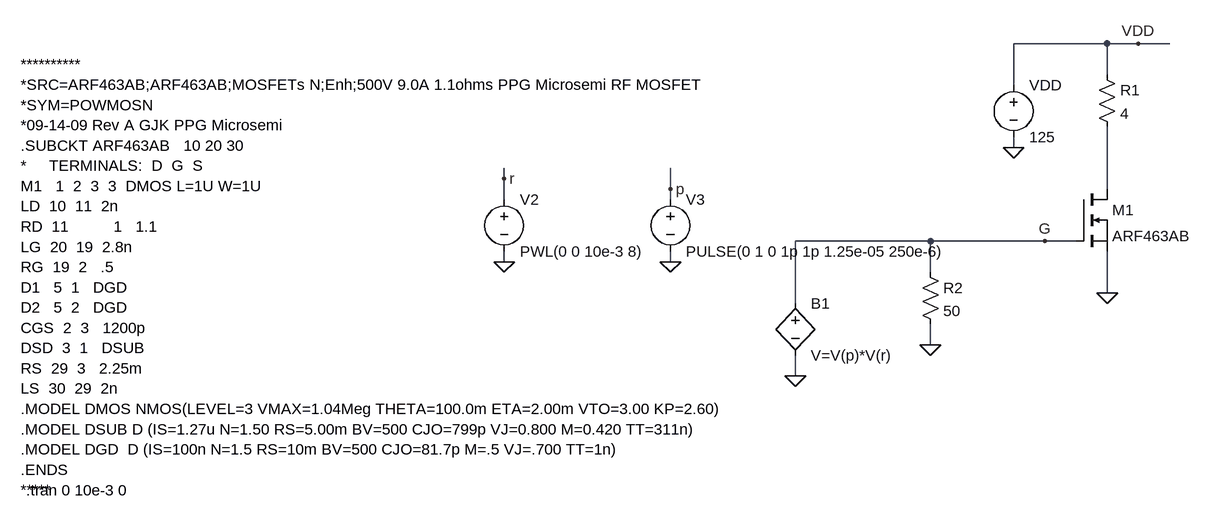
[diagram p0: schematic mosfet.asc]
mosfet.asc, the LTspice schematic file:
Version 4
SHEET 1 880 680
WIRE -480 -784 -624 -784
WIRE -432 -784 -480 -784
WIRE -384 -784 -432 -784
WIRE -480 -736 -480 -784
WIRE -624 -720 -624 -784
WIRE -624 -624 -624 -640
WIRE -1408 -576 -1408 -592
WIRE -1152 -560 -1152 -592
WIRE -480 -560 -480 -656
WIRE -1408 -544 -1408 -576
WIRE -1152 -544 -1152 -560
WIRE -752 -480 -960 -480
WIRE -576 -480 -752 -480
WIRE -528 -480 -576 -480
WIRE -1408 -448 -1408 -464
WIRE -1152 -448 -1152 -464
WIRE -752 -432 -752 -480
WIRE -480 -400 -480 -464
WIRE -960 -384 -960 -480
WIRE -752 -320 -752 -352
WIRE -960 -272 -960 -304
FLAG -480 -400 0
FLAG -624 -624 0
FLAG -432 -784 VDD
FLAG -576 -480 G
FLAG -752 -320 0
FLAG -960 -272 0
FLAG -1408 -448 0
FLAG -1152 -448 0
FLAG -1152 -560 p
FLAG -1408 -576 r
SYMBOL nmos -528 -560 R0
SYMATTR InstName M1
SYMATTR Value ARF463AB
SYMATTR Prefix X
SYMBOL voltage -624 -736 R0
WINDOW 123 0 0 Left 2
WINDOW 39 0 0 Left 2
SYMATTR InstName VDD
SYMATTR Value 125
SYMBOL res -496 -752 R0
SYMATTR InstName R1
SYMATTR Value 4
SYMBOL res -768 -448 R0
SYMATTR InstName R2
SYMATTR Value 50
SYMBOL bv -960 -400 R0
SYMATTR InstName B1
SYMATTR Value V=V(p)*V(r)
SYMBOL voltage -1408 -560 R0
WINDOW 123 0 0 Left 2
WINDOW 39 0 0 Left 2
SYMATTR InstName V2
SYMATTR Value PWL(0 0 10e-3 8)
SYMBOL voltage -1152 -560 R0
WINDOW 123 0 0 Left 2
WINDOW 39 0 0 Left 2
SYMATTR InstName V3
SYMATTR Value PULSE(0 1 0 1p 1p 1.25e-05 250e-6)
TEXT -2144 -96 Left 2 !.tran 0 10e-3 0
TEXT -2152 -752 Left 2 !**********\n*SRC=ARF463AB;ARF463AB;MOSFETs N;Enh;500V 9.0A 1.1ohms PPG Microsemi RF MOSFET\n*SYM=POWMOSN\n*09-14-09 Rev A GJK PPG Microsemi\n.SUBCKT ARF463AB   10 20 30\n*     TERMINALS:  D  G  S\nM1   1  2  3  3  DMOS L=1U W=1U\nLD  10  11  2n\nRD  11          1   1.1\nLG  20  19  2.8n\nRG  19  2   .5\nD1   5  1   DGD\nD2   5  2   DGD\nCGS  2  3   1200p\nDSD  3  1   DSUB\nRS  29  3   2.25m\nLS  30  29  2n\n.MODEL DMOS NMOS(LEVEL=3 VMAX=1.04Meg THETA=100.0m ETA=2.00m VTO=3.00 KP=2.60)\n.MODEL DSUB D (IS=1.27u N=1.50 RS=5.00m BV=500 CJO=799p VJ=0.800 M=0.420 TT=311n)\n.MODEL DGD  D (IS=100n N=1.5 RS=10m BV=500 CJO=81.7p M=.5 VJ=.700 TT=1n)\n.ENDS\n*****

The netlist it stands for:
* mosfet.asc
XM1 N001 G 0 ARF463AB  ; pins D G S
VDD VDD 0 125
R1 VDD N001 4
R2 G 0 50
B1 G 0 V=V(p)*V(r)
V2 r 0 PWL(0 0 10e-3 8)
V3 p 0 PULSE(0 1 0 1p 1p 1.25e-05 250e-6)
.tran 0 10e-3 0
**********
*SRC=ARF463AB;ARF463AB;MOSFETs N;Enh;500V 9.0A 1.1ohms PPG Microsemi RF MOSFET
*SYM=POWMOSN
*09-14-09 Rev A GJK PPG Microsemi
.SUBCKT ARF463AB   10 20 30
*     TERMINALS:  D  G  S
M1   1  2  3  3  DMOS L=1U W=1U
LD  10  11  2n
RD  11          1   1.1
LG  20  19  2.8n
RG  19  2   .5
D1   5  1   DGD
D2   5  2   DGD
CGS  2  3   1200p
DSD  3  1   DSUB
RS  29  3   2.25m
LS  30  29  2n
.MODEL DMOS NMOS(LEVEL=3 VMAX=1.04Meg THETA=100.0m ETA=2.00m VTO=3.00 KP=2.60)
.MODEL DSUB D (IS=1.27u N=1.50 RS=5.00m BV=500 CJO=799p VJ=0.800 M=0.420 TT=311n)
.MODEL DGD  D (IS=100n N=1.5 RS=10m BV=500 CJO=81.7p M=.5 VJ=.700 TT=1n)
.ENDS
*****
.backanno
.end